# Altium schematic sheet Inverted_Pendulum_Cape.SchDoc: TITLE:
size 270 x 207 mm; Date: Date:; >LAST_DATE_TIME: 5/08/2015 9:26:59 PM; Sheet:: Sheet:; >SHEET: 1; REV:: REV:; >DRAWING_NAME: Inverted_Pendulum_Cape.sch; Released under the Creative Commons: Released under the Creative Commons; Attribution Share-Alike 3.0 License: Attribution Share-Alike 3.0 License; http://creativecommons.org/licenses/by-sa/3.0: http://creativecommons.org/licenses/by-sa/3.0; Design by:: Design by:
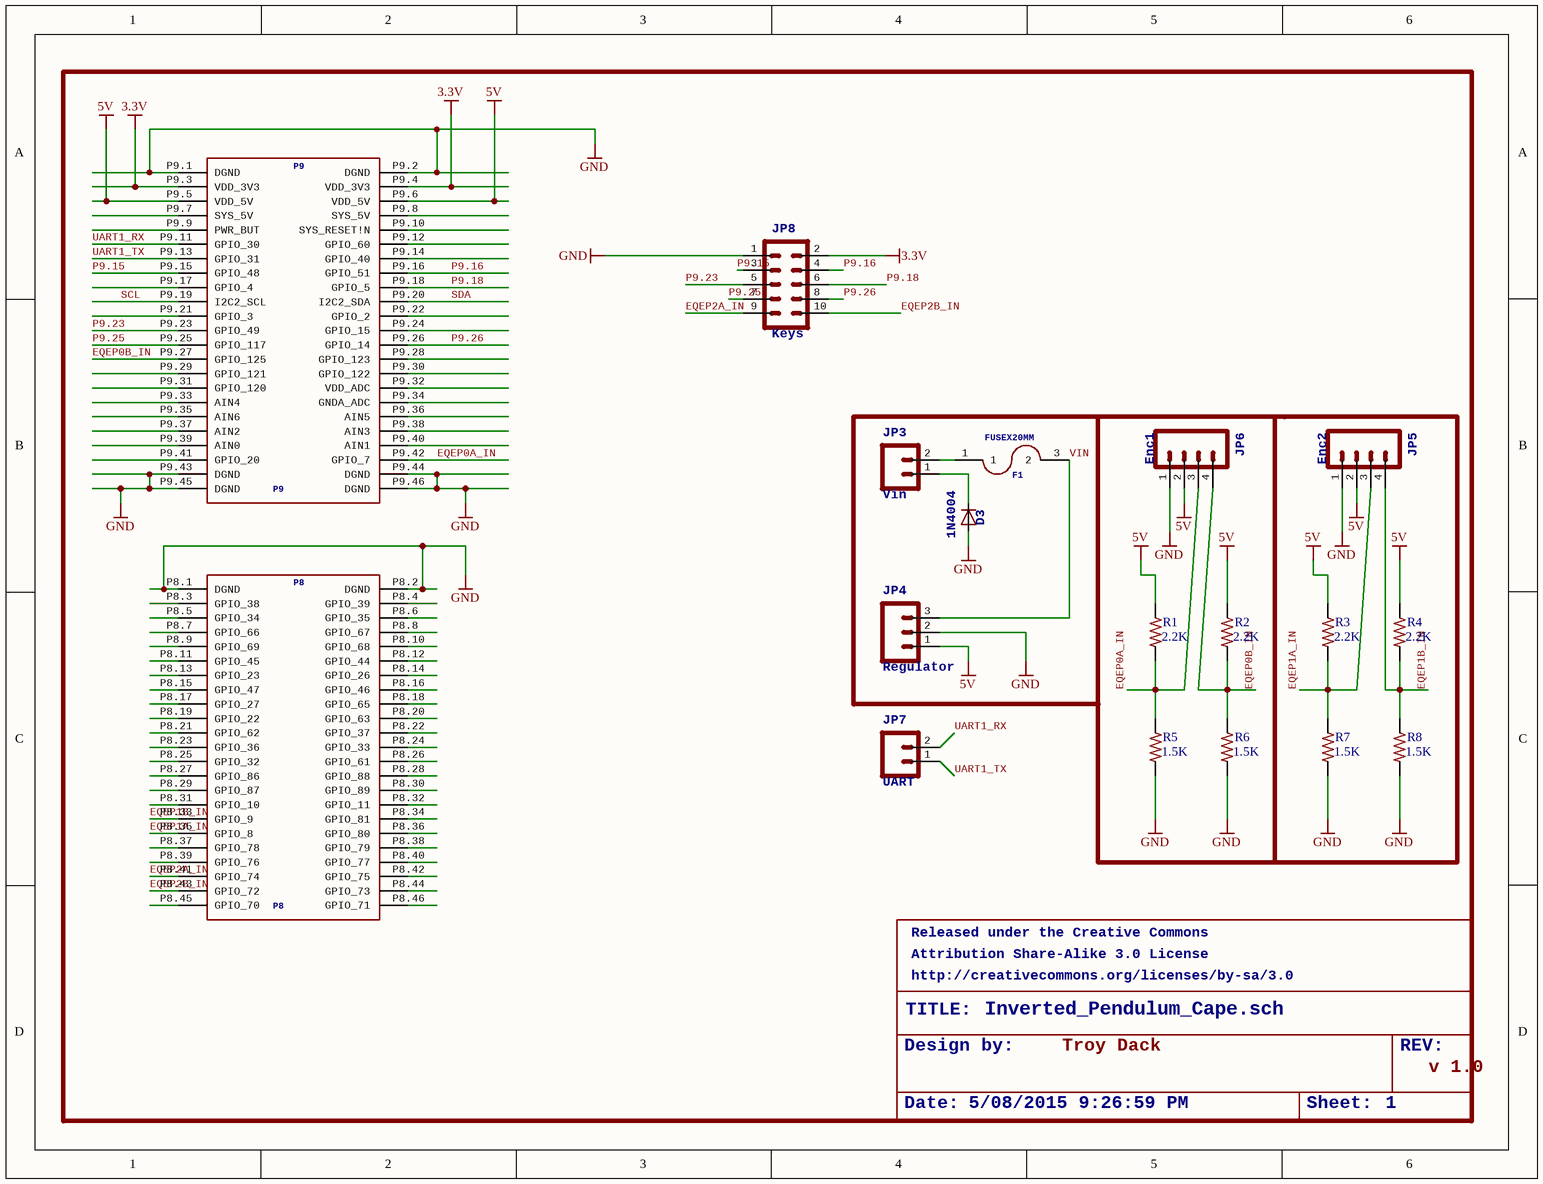
[diagram p0: Inverted_Pendulum_Cape.SchDoc]

## Parts
D3  1N4004  [DO41-10]
F1  FUSEX20MM  [FUSE_5MM]
JP3  >NAME: JP3  [MOLEX-1X2]  (hidden comment: Vin)
JP4  >NAME: JP4  [1X03]  (hidden comment: Regulator)
JP5  >NAME: JP5  [MOLEX-1X4]  (hidden comment: Enc2)
JP6  >NAME: JP6  [MOLEX-1X4]  (hidden comment: Enc1)
JP7  >NAME: JP7  [MOLEX-1X2]  (hidden comment: UART)
JP8  Keys  [2X5_PTH_SILK_.05]
R1  value 2.2K  [1206]  (hidden comment: RESISTOR1206)
R2  value 2.2K  [1206]  (hidden comment: RESISTOR1206)
R3  value 2.2K  [1206]  (hidden comment: RESISTOR1206)
R4  value 2.2K  [1206]  (hidden comment: RESISTOR1206)
R5  value 1.5K  [1206]  (hidden comment: RESISTOR1206)
R6  value 1.5K  [1206]  (hidden comment: RESISTOR1206)
R7  value 1.5K  [1206]  (hidden comment: RESISTOR1206)
R8  value 1.5K  [1206]  (hidden comment: RESISTOR1206)
U$1  BEAGLE_BONE_BLACK_CAPE  [BEAGLE_BONE_BLACK_CAPE]  (value not drawn)  (parts A,B of 2)

## Nets
3.3V: JP8.2 U$1.P9.3(VDD_3V3) U$1.P9.4(VDD_3V3)
5V: JP4.1 JP5.2 JP6.2 R1.1 R2.1 R3.1 R4.1 U$1.P9.5(VDD_5V) U$1.P9.6(VDD_5V)
GND: D3.A JP4.2 JP5.1 JP6.1 JP8.1 R5.2 R6.2 R7.2 R8.2 U$1.P8.1(DGND) U$1.P8.2(DGND) U$1.P9.1(DGND) U$1.P9.2(DGND) U$1.P9.43(DGND) U$1.P9.44(DGND) U$1.P9.45(DGND) U$1.P9.46(DGND)
EQEP0A_IN: JP6.3 R1.2 R5.1 U$1.P9.42(GPIO_7)
EQEP0B_IN: JP6.4 R2.2 R6.1 U$1.P9.27(GPIO_125)
EQEP1A_IN: JP5.3 R3.2 R7.1 U$1.P8.35(GPIO_8)
EQEP1B_IN: JP5.4 R4.2 R8.1 U$1.P8.33(GPIO_9)
EQEP2A_IN: JP8.9 U$1.P8.41(GPIO_74)
EQEP2B_IN: JP8.10 U$1.P8.43(GPIO_72)
P9.15: JP8.3 U$1.P9.15(GPIO_48)
P9.16: JP8.4 U$1.P9.16(GPIO_51)
P9.18: JP8.6 U$1.P9.18(GPIO_5)
P9.23: JP8.5 U$1.P9.23(GPIO_49)
P9.25: JP8.7 U$1.P9.25(GPIO_117)
P9.26: JP8.8 U$1.P9.26(GPIO_14)
SCL: U$1.P9.19(I2C2_SCL)
SDA: U$1.P9.20(I2C2_SDA)
UART1_RX: JP7.2 U$1.P9.11(GPIO_30)
UART1_TX: JP7.1 U$1.P9.13(GPIO_31)
VIN: F1.3(2) JP4.3
NetD3_C: D3.C JP3.1
NetF1_1: F1.1 JP3.2

Not connected (* = marked no-connect by the designer): U$1 P8.3(GPIO_38) P8.4(GPIO_39) P8.5(GPIO_34) P8.6(GPIO_35) P8.7(GPIO_66) P8.8(GPIO_67) P8.9(GPIO_69) P8.10(GPIO_68) P8.11(GPIO_45) P8.12(GPIO_44) P8.13(GPIO_23) P8.14(GPIO_26) P8.15(GPIO_47) P8.16(GPIO_46) P8.17(GPIO_27) P8.18(GPIO_65) P8.19(GPIO_22) P8.20(GPIO_63) P8.21(GPIO_62) P8.22(GPIO_37) P8.23(GPIO_36) P8.24(GPIO_33) P8.25(GPIO_32) P8.26(GPIO_61) P8.27(GPIO_86) P8.28(GPIO_88) P8.29(GPIO_87) P8.30(GPIO_89) P8.31(GPIO_10) P8.32(GPIO_11) P8.34(GPIO_81) P8.36(GPIO_80) P8.37(GPIO_78) P8.38(GPIO_79) P8.39(GPIO_76) P8.40(GPIO_77) P8.42(GPIO_75) P8.44(GPIO_73) P8.45(GPIO_70) P8.46(GPIO_71) P9.7(SYS_5V) P9.8(SYS_5V) P9.9(PWR_BUT) P9.10(SYS_RESET!N) P9.12(GPIO_60) P9.14(GPIO_40) P9.17(GPIO_4) P9.21(GPIO_3) P9.22(GPIO_2) P9.24(GPIO_15) P9.28(GPIO_123) P9.29(GPIO_121) P9.30(GPIO_122) P9.31(GPIO_120) P9.32(VDD_ADC) P9.33(AIN4) P9.34(GNDA_ADC) P9.35(AIN6) P9.36(AIN5) P9.37(AIN2) P9.38(AIN3) P9.39(AIN0) P9.40(AIN1) P9.41(GPIO_20)

## Notes on the sheet
- Troy Dack
- v 1.0

## Library data of the parts
D3 = 1N4004: <B>DIODE</B><p> / general purpose rectifier, 1 A
JP3 JP7 = M02POLAR: Standard 2-pin 0.1" header. Use with <br> / - straight break away headers ( PRT-00116)<br> / - right angle break away headers (PRT-00553)<br> / - swiss pins (PRT-00743)<br> / - machine pins (PRT-00117)<br> / - female headers (PRT-00115)<br><br> / Molex polarized connector foot print use with: PRT-08233 with associated crimp pins and housings.<br><br> / 2.54_SCREWTERM for use with  PRT-10571.<br><br> / 3.5mm Screw Terminal footprints for  PRT-08084<br><br> / 5mm Screw Terminal footprints for use with PRT-08432; MF: MOLEX; MPN: 22-27-2021; OC_FARNELL: 9731148
  JP3: >VALUE: Vin
  JP7: >VALUE: UART
JP4 = M03PTH: <b>Header 3</b> / Standard 3-pin 0.1" header. Use with straight break away headers (SKU : PRT-00116), right angle break away headers (PRT-00553), swiss pins (PRT-00743), machine pins (PRT-00117), and female headers (PRT-00115). Molex polarized connector foot print use with SKU : PRT-08232 with associated crimp pins and housings.; MPN: OKI-78SR-5/1.5-W36-C.; MF: MURATA POWER SOLUTIONS; OC_FARNELL: 1814499; >VALUE: Regulator
JP5 JP6 = M04POLAR: <b>Header 4</b> / Standard 4-pin 0.1" header. Use with straight break away headers (SKU : PRT-00116), right angle break away headers (PRT-00553), swiss pins (PRT-00743), machine pins (PRT-00117), and female headers (PRT-00115). Molex polarized connector foot print use with SKU : PRT-08231 with associated crimp pins and housings. 1MM SMD Version SKU: PRT-10208; MF: MOLEX; MPN: 22-27-2041; OC_FARNELL: 9731164
  JP5: >VALUE: Enc2
  JP6: >VALUE: Enc1
JP8 = M05X20.05_IN_PTH_SILK: <b>Header 5x2</b> / Standard 10-pin dual row 0.1" header. Commonly used with AVR-ISP. Use with Spark Fun Electronics SKU: PRT-00778
U$1 = BEAGLE_BONE_BLACK_CAPE: OC_FARNELL: unknown; P8: P8